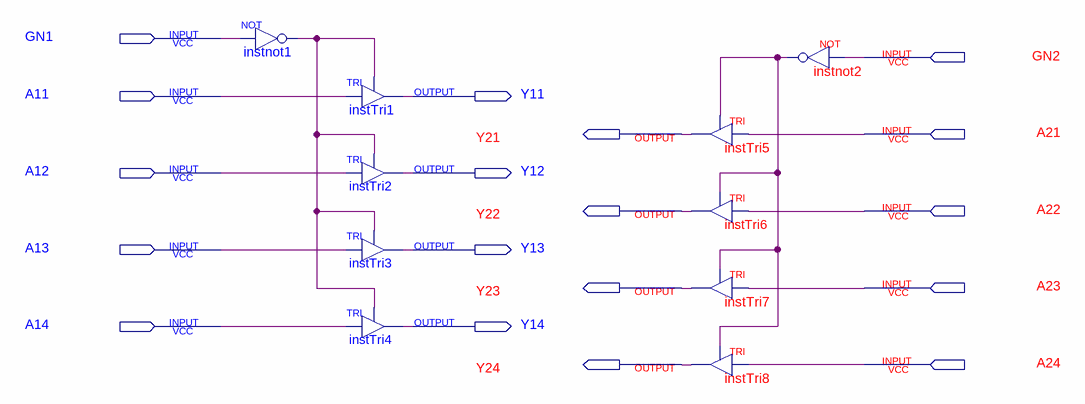
[diagram p0: schematic sheet]
// Quartus schematic CI74244_Buffer_Tristate_Unidirecional.bdf as structural Verilog: 10 symbols, 18 pins
module CI74244_Buffer_Tristate_Unidirecional (
  input  GN1,
  input  GN2,
  input  A11,
  input  A21,
  input  A12,
  input  A22,
  input  A13,
  input  A23,
  input  A14,
  input  A24,
  output Y11,
  output Y21,
  output Y12,
  output Y22,
  output Y13,
  output Y23,
  output Y14,
  output Y24
);

  wire instnot1_out, instnot2_out;

  not instnot1 (instnot1_out, GN1);
  TRI instTri1 (.IN(A11), .OE(instnot1_out), .OUT(Y11));
  TRI instTri2 (.IN(A12), .OE(instnot1_out), .OUT(Y12));
  TRI instTri3 (.IN(A13), .OE(instnot1_out), .OUT(Y13));
  TRI instTri4 (.IN(A14), .OE(instnot1_out), .OUT(Y14));
  TRI instTri5 (.IN(A21), .OE(instnot2_out), .OUT(Y21));
  TRI instTri6 (.IN(A22), .OE(instnot2_out), .OUT(Y22));
  TRI instTri7 (.IN(A23), .OE(instnot2_out), .OUT(Y23));
  TRI instTri8 (.IN(A24), .OE(instnot2_out), .OUT(Y24));
  not instnot2 (instnot2_out, GN2);
endmodule
